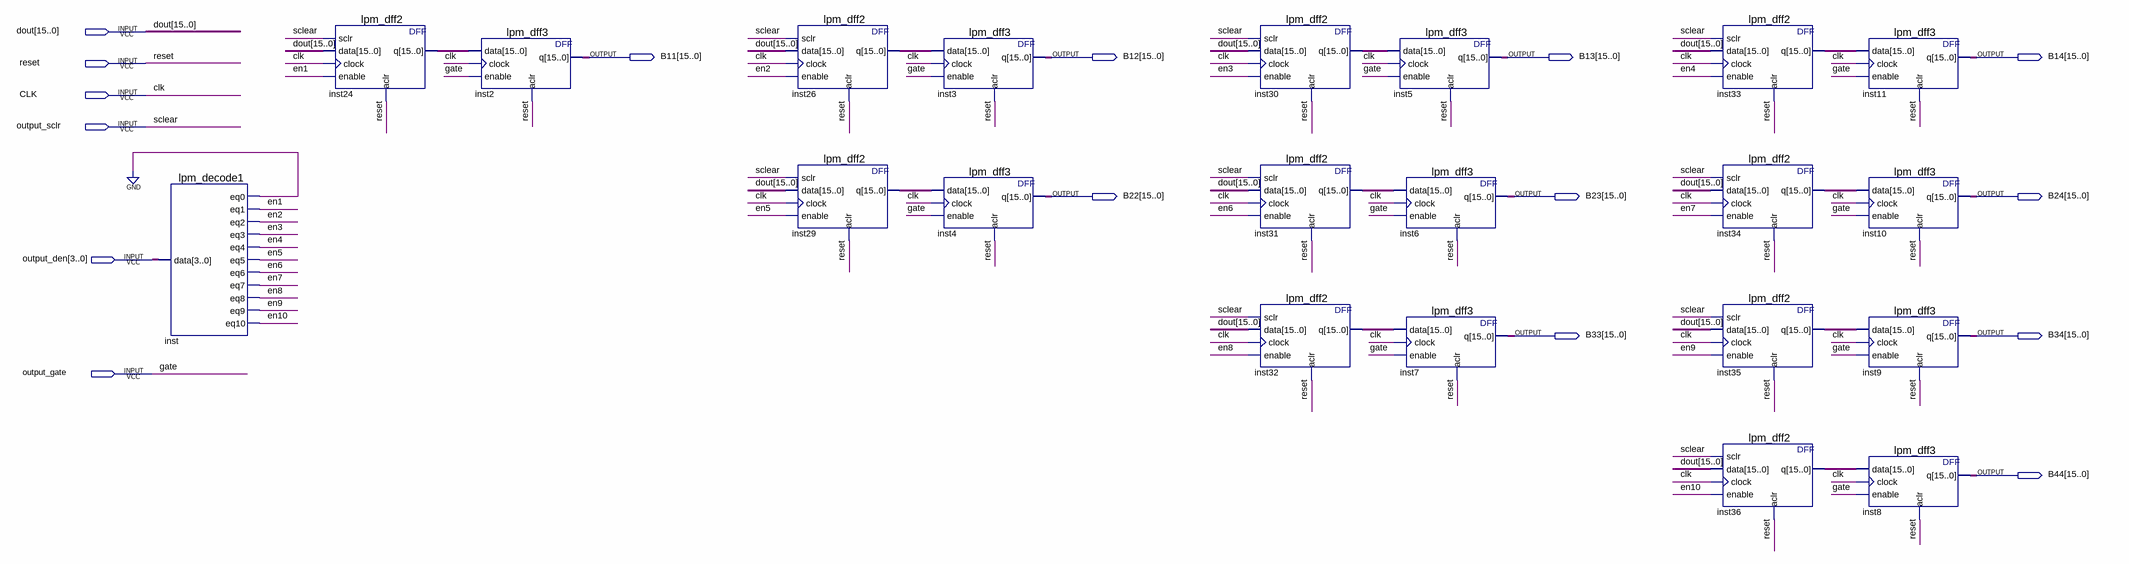
[diagram p0: schematic sheet]
// Quartus schematic output_reg.bdf as structural Verilog: 21 symbols, 16 pins
module output_reg (
  input  [15:0] dout,
  input  reset,
  input  CLK,
  input  output_sclr,
  input  [3:0] output_den,
  input  output_gate,
  output [15:0] B11,
  output [15:0] B12,
  output [15:0] B13,
  output [15:0] B14,
  output [15:0] B22,
  output [15:0] B23,
  output [15:0] B24,
  output [15:0] B33,
  output [15:0] B34,
  output [15:0] B44
);

  wire en1, en2, en3, en4, en5, en6, en7, en8, en9, en10, inst_eq0;
  wire [15:0] inst24_q, inst26_q, inst29_q, inst30_q, inst31_q, inst32_q, inst33_q, inst34_q, inst35_q,
       inst36_q;

  lpm_decode1 inst (
    .data(output_den), .eq0(inst_eq0), .eq1(en1), .eq2(en2), .eq3(en3), .eq4(en4), .eq5(en5), .eq6(en6),
    .eq7(en7), .eq8(en8), .eq9(en9), .eq10(en10));
  lpm_dff2 inst24 (.sclr(output_sclr), .data(dout), .clock(CLK), .enable(en1), .aclr(reset), .q(inst24_q));
  lpm_dff3 inst2 (.data(inst24_q), .clock(CLK), .enable(output_gate), .aclr(reset), .q(B11));
  lpm_dff2 inst26 (.sclr(output_sclr), .data(dout), .clock(CLK), .enable(en2), .aclr(reset), .q(inst26_q));
  lpm_dff2 inst29 (.sclr(output_sclr), .data(dout), .clock(CLK), .enable(en5), .aclr(reset), .q(inst29_q));
  lpm_dff3 inst3 (.data(inst26_q), .clock(CLK), .enable(output_gate), .aclr(reset), .q(B12));
  lpm_dff3 inst4 (.data(inst29_q), .clock(CLK), .enable(output_gate), .aclr(reset), .q(B22));
  lpm_dff2 inst30 (.sclr(output_sclr), .data(dout), .clock(CLK), .enable(en3), .aclr(reset), .q(inst30_q));
  lpm_dff2 inst31 (.sclr(output_sclr), .data(dout), .clock(CLK), .enable(en6), .aclr(reset), .q(inst31_q));
  lpm_dff2 inst32 (.sclr(output_sclr), .data(dout), .clock(CLK), .enable(en8), .aclr(reset), .q(inst32_q));
  lpm_dff3 inst5 (.data(inst30_q), .clock(CLK), .enable(output_gate), .aclr(reset), .q(B13));
  lpm_dff3 inst6 (.data(inst31_q), .clock(CLK), .enable(output_gate), .aclr(reset), .q(B23));
  lpm_dff3 inst7 (.data(inst32_q), .clock(CLK), .enable(output_gate), .aclr(reset), .q(B33));
  lpm_dff2 inst33 (.sclr(output_sclr), .data(dout), .clock(CLK), .enable(en4), .aclr(reset), .q(inst33_q));
  lpm_dff2 inst34 (.sclr(output_sclr), .data(dout), .clock(CLK), .enable(en7), .aclr(reset), .q(inst34_q));
  lpm_dff2 inst35 (.sclr(output_sclr), .data(dout), .clock(CLK), .enable(en9), .aclr(reset), .q(inst35_q));
  lpm_dff2 inst36 (.sclr(output_sclr), .data(dout), .clock(CLK), .enable(en10), .aclr(reset), .q(inst36_q));
  lpm_dff3 inst11 (.data(inst33_q), .clock(CLK), .enable(output_gate), .aclr(reset), .q(B14));
  lpm_dff3 inst10 (.data(inst34_q), .clock(CLK), .enable(output_gate), .aclr(reset), .q(B24));
  lpm_dff3 inst9 (.data(inst35_q), .clock(CLK), .enable(output_gate), .aclr(reset), .q(B34));
  lpm_dff3 inst8 (.data(inst36_q), .clock(CLK), .enable(output_gate), .aclr(reset), .q(B44));
  // also tied to GND on the sheet: inst_eq0

  // Other names for the same wires on the sheet: gate = output_gate; sclear = output_sclr
endmodule
